# Altium schematic sheet LEDS3.SchDoc: LEDBO - LRTBR98G (LEDS 3)
size B; Author: Sébastien Gélinas; Organization: SmartHalo; Address1: 5445 de Gaspé; Address2: Montréal, QC; Address3: Canada; Address4: H2T 3B2; Revision: 1; SheetNumber: 5; SheetTotal: 5
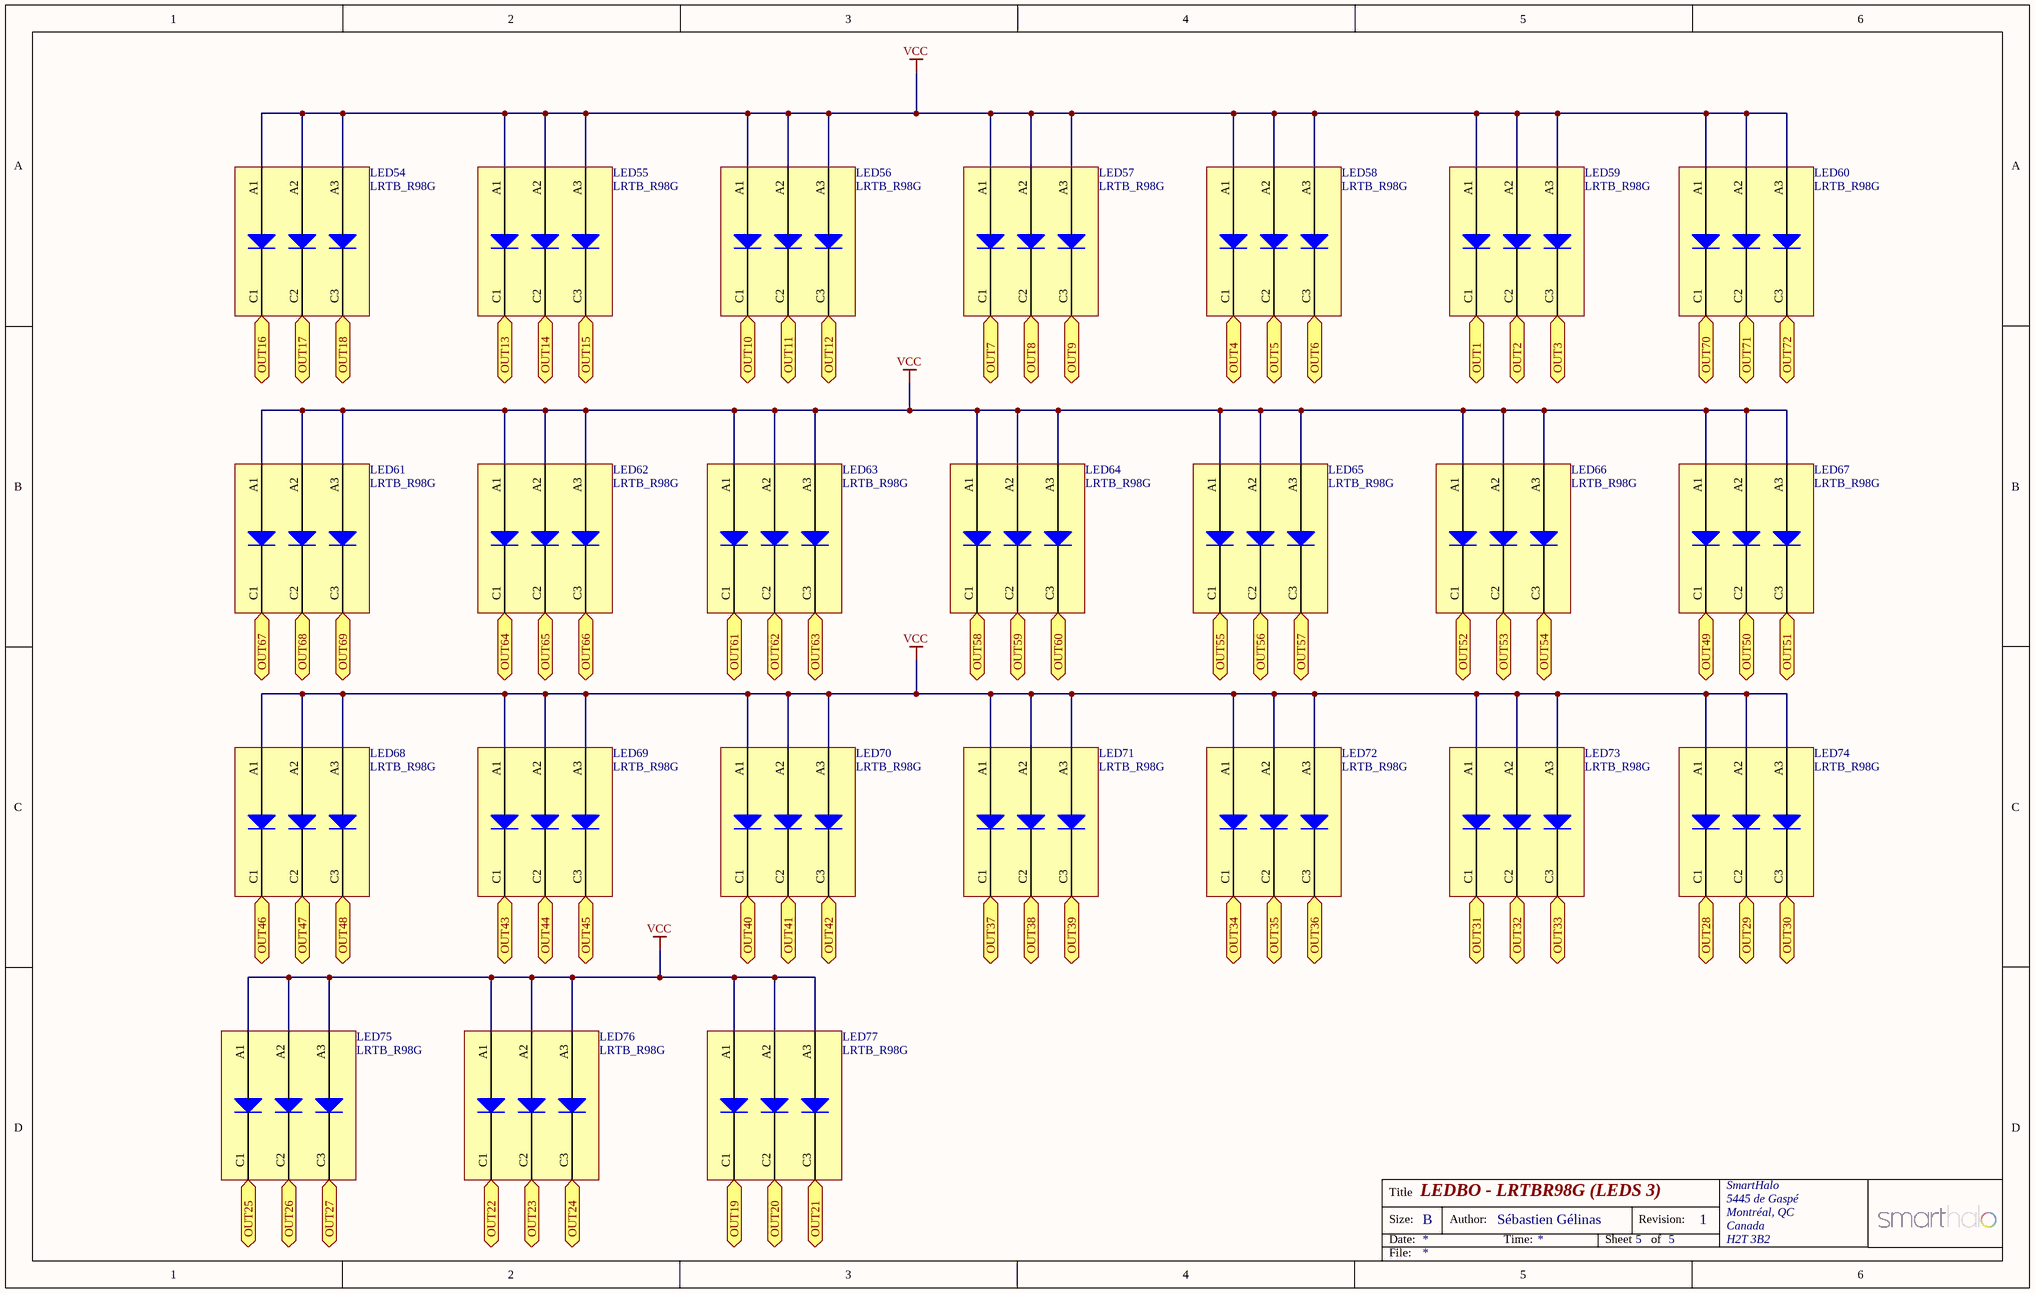
[diagram p0: LEDS3.SchDoc]

## Parts
LED54  LRTB_R98G  [LRTB_R98G]
LED55  LRTB_R98G  [LRTB_R98G]
LED56  LRTB_R98G  [LRTB_R98G]
LED57  LRTB_R98G  [LRTB_R98G]
LED58  LRTB_R98G  [LRTB_R98G]
LED59  LRTB_R98G  [LRTB_R98G]
LED60  LRTB_R98G  [LRTB_R98G]
LED61  LRTB_R98G  [LRTB_R98G]
LED62  LRTB_R98G  [LRTB_R98G]
LED63  LRTB_R98G  [LRTB_R98G]
LED64  LRTB_R98G  [LRTB_R98G]
LED65  LRTB_R98G  [LRTB_R98G]
LED66  LRTB_R98G  [LRTB_R98G]
LED67  LRTB_R98G  [LRTB_R98G]
LED68  LRTB_R98G  [LRTB_R98G]
LED69  LRTB_R98G  [LRTB_R98G]
LED70  LRTB_R98G  [LRTB_R98G]
LED71  LRTB_R98G  [LRTB_R98G]
LED72  LRTB_R98G  [LRTB_R98G]
LED73  LRTB_R98G  [LRTB_R98G]
LED74  LRTB_R98G  [LRTB_R98G]
LED75  LRTB_R98G  [LRTB_R98G]
LED76  LRTB_R98G  [LRTB_R98G]
LED77  LRTB_R98G  [LRTB_R98G]

## Ports
OUT1, OUT2, OUT3, OUT4, OUT5, OUT6, OUT7, OUT8, OUT9, OUT10, OUT11, OUT12, OUT13, OUT14, OUT15, OUT16, OUT17, OUT18, OUT19, OUT20, OUT21, OUT22, OUT23, OUT24, OUT25, OUT26, OUT27, OUT28, OUT29, OUT30, OUT31, OUT32, OUT33, OUT34, OUT35, OUT36, OUT37, OUT38, OUT39, OUT40, OUT41, OUT42, OUT43, OUT44, OUT45, OUT46, OUT47, OUT48, OUT49, OUT50, OUT51, OUT52, OUT53, OUT54, OUT55, OUT56, OUT57, OUT58, OUT59, OUT60, OUT61, OUT62, OUT63, OUT64, OUT65, OUT66, OUT67, OUT68, OUT69, OUT70, OUT71, OUT72

## Nets
VCC: LED54.A1(Anode_Blue) LED54.A2(Anode_Green) LED54.A3(Anode_Red) LED55.A1(Anode_Blue) LED55.A2(Anode_Green) LED55.A3(Anode_Red) LED56.A1(Anode_Blue) LED56.A2(Anode_Green) LED56.A3(Anode_Red) LED57.A1(Anode_Blue) LED57.A2(Anode_Green) LED57.A3(Anode_Red) LED58.A1(Anode_Blue) LED58.A2(Anode_Green) LED58.A3(Anode_Red) LED59.A1(Anode_Blue) LED59.A2(Anode_Green) LED59.A3(Anode_Red) LED60.A1(Anode_Blue) LED60.A2(Anode_Green) LED60.A3(Anode_Red) LED61.A1(Anode_Blue) LED61.A2(Anode_Green) LED61.A3(Anode_Red) LED62.A1(Anode_Blue) LED62.A2(Anode_Green) LED62.A3(Anode_Red) LED63.A1(Anode_Blue) LED63.A2(Anode_Green) LED63.A3(Anode_Red) LED64.A1(Anode_Blue) LED64.A2(Anode_Green) LED64.A3(Anode_Red) LED65.A1(Anode_Blue) LED65.A2(Anode_Green) LED65.A3(Anode_Red) LED66.A1(Anode_Blue) LED66.A2(Anode_Green) LED66.A3(Anode_Red) LED67.A1(Anode_Blue) LED67.A2(Anode_Green) LED67.A3(Anode_Red) LED68.A1(Anode_Blue) LED68.A2(Anode_Green) LED68.A3(Anode_Red) LED69.A1(Anode_Blue) LED69.A2(Anode_Green) LED69.A3(Anode_Red) LED70.A1(Anode_Blue) LED70.A2(Anode_Green) LED70.A3(Anode_Red) LED71.A1(Anode_Blue) LED71.A2(Anode_Green) LED71.A3(Anode_Red) LED72.A1(Anode_Blue) LED72.A2(Anode_Green) LED72.A3(Anode_Red) LED73.A1(Anode_Blue) LED73.A2(Anode_Green) LED73.A3(Anode_Red) LED74.A1(Anode_Blue) LED74.A2(Anode_Green) LED74.A3(Anode_Red) LED75.A1(Anode_Blue) LED75.A2(Anode_Green) LED75.A3(Anode_Red) LED76.A1(Anode_Blue) LED76.A2(Anode_Green) LED76.A3(Anode_Red) LED77.A1(Anode_Blue) LED77.A2(Anode_Green) LED77.A3(Anode_Red)
OUT1: LED59.C1(Cathode_Blue) ; port OUT1
OUT2: LED59.C2(Cathode_Green) ; port OUT2
OUT3: LED59.C3(Cathode_Red) ; port OUT3
OUT4: LED58.C1(Cathode_Blue) ; port OUT4
OUT5: LED58.C2(Cathode_Green) ; port OUT5
OUT6: LED58.C3(Cathode_Red) ; port OUT6
OUT7: LED57.C1(Cathode_Blue) ; port OUT7
OUT8: LED57.C2(Cathode_Green) ; port OUT8
OUT9: LED57.C3(Cathode_Red) ; port OUT9
OUT10: LED56.C1(Cathode_Blue) ; port OUT10
OUT11: LED56.C2(Cathode_Green) ; port OUT11
OUT12: LED56.C3(Cathode_Red) ; port OUT12
OUT13: LED55.C1(Cathode_Blue) ; port OUT13
OUT14: LED55.C2(Cathode_Green) ; port OUT14
OUT15: LED55.C3(Cathode_Red) ; port OUT15
OUT16: LED54.C1(Cathode_Blue) ; port OUT16
OUT17: LED54.C2(Cathode_Green) ; port OUT17
OUT18: LED54.C3(Cathode_Red) ; port OUT18
OUT19: LED77.C1(Cathode_Blue) ; port OUT19
OUT20: LED77.C2(Cathode_Green) ; port OUT20
OUT21: LED77.C3(Cathode_Red) ; port OUT21
OUT22: LED76.C1(Cathode_Blue) ; port OUT22
OUT23: LED76.C2(Cathode_Green) ; port OUT23
OUT24: LED76.C3(Cathode_Red) ; port OUT24
OUT25: LED75.C1(Cathode_Blue) ; port OUT25
OUT26: LED75.C2(Cathode_Green) ; port OUT26
OUT27: LED75.C3(Cathode_Red) ; port OUT27
OUT28: LED74.C1(Cathode_Blue) ; port OUT28
OUT29: LED74.C2(Cathode_Green) ; port OUT29
OUT30: LED74.C3(Cathode_Red) ; port OUT30
OUT31: LED73.C1(Cathode_Blue) ; port OUT31
OUT32: LED73.C2(Cathode_Green) ; port OUT32
OUT33: LED73.C3(Cathode_Red) ; port OUT33
OUT34: LED72.C1(Cathode_Blue) ; port OUT34
OUT35: LED72.C2(Cathode_Green) ; port OUT35
OUT36: LED72.C3(Cathode_Red) ; port OUT36
OUT37: LED71.C1(Cathode_Blue) ; port OUT37
OUT38: LED71.C2(Cathode_Green) ; port OUT38
OUT39: LED71.C3(Cathode_Red) ; port OUT39
OUT40: LED70.C1(Cathode_Blue) ; port OUT40
OUT41: LED70.C2(Cathode_Green) ; port OUT41
OUT42: LED70.C3(Cathode_Red) ; port OUT42
OUT43: LED69.C1(Cathode_Blue) ; port OUT43
OUT44: LED69.C2(Cathode_Green) ; port OUT44
OUT45: LED69.C3(Cathode_Red) ; port OUT45
OUT46: LED68.C1(Cathode_Blue) ; port OUT46
OUT47: LED68.C2(Cathode_Green) ; port OUT47
OUT48: LED68.C3(Cathode_Red) ; port OUT48
OUT49: LED67.C1(Cathode_Blue) ; port OUT49
OUT50: LED67.C2(Cathode_Green) ; port OUT50
OUT51: LED67.C3(Cathode_Red) ; port OUT51
OUT52: LED66.C1(Cathode_Blue) ; port OUT52
OUT53: LED66.C2(Cathode_Green) ; port OUT53
OUT54: LED66.C3(Cathode_Red) ; port OUT54
OUT55: LED65.C1(Cathode_Blue) ; port OUT55
OUT56: LED65.C2(Cathode_Green) ; port OUT56
OUT57: LED65.C3(Cathode_Red) ; port OUT57
OUT58: LED64.C1(Cathode_Blue) ; port OUT58
OUT59: LED64.C2(Cathode_Green) ; port OUT59
OUT60: LED64.C3(Cathode_Red) ; port OUT60
OUT61: LED63.C1(Cathode_Blue) ; port OUT61
OUT62: LED63.C2(Cathode_Green) ; port OUT62
OUT63: LED63.C3(Cathode_Red) ; port OUT63
OUT64: LED62.C1(Cathode_Blue) ; port OUT64
OUT65: LED62.C2(Cathode_Green) ; port OUT65
OUT66: LED62.C3(Cathode_Red) ; port OUT66
OUT67: LED61.C1(Cathode_Blue) ; port OUT67
OUT68: LED61.C2(Cathode_Green) ; port OUT68
OUT69: LED61.C3(Cathode_Red) ; port OUT69
OUT70: LED60.C1(Cathode_Blue) ; port OUT70
OUT71: LED60.C2(Cathode_Green) ; port OUT71
OUT72: LED60.C3(Cathode_Red) ; port OUT72

## Notes on the sheet
- Title
- Size:
- Date:
- B
- Author:
- Time:
- Sheet
- Revision:
- of
- File:

## Library data of the parts
LED54-LED77 = LRTB_R98G: IC RGB LED OSRAM; Manufacturer: OSRAM